# EasyEDA schematic Stepper Hat Trio V3.9.json
TITLE: Pi ESP Stepper HAT; REV: 3.9; Date: 2019-09-20; Sheet: 1/1; Drawn By: robdobsn
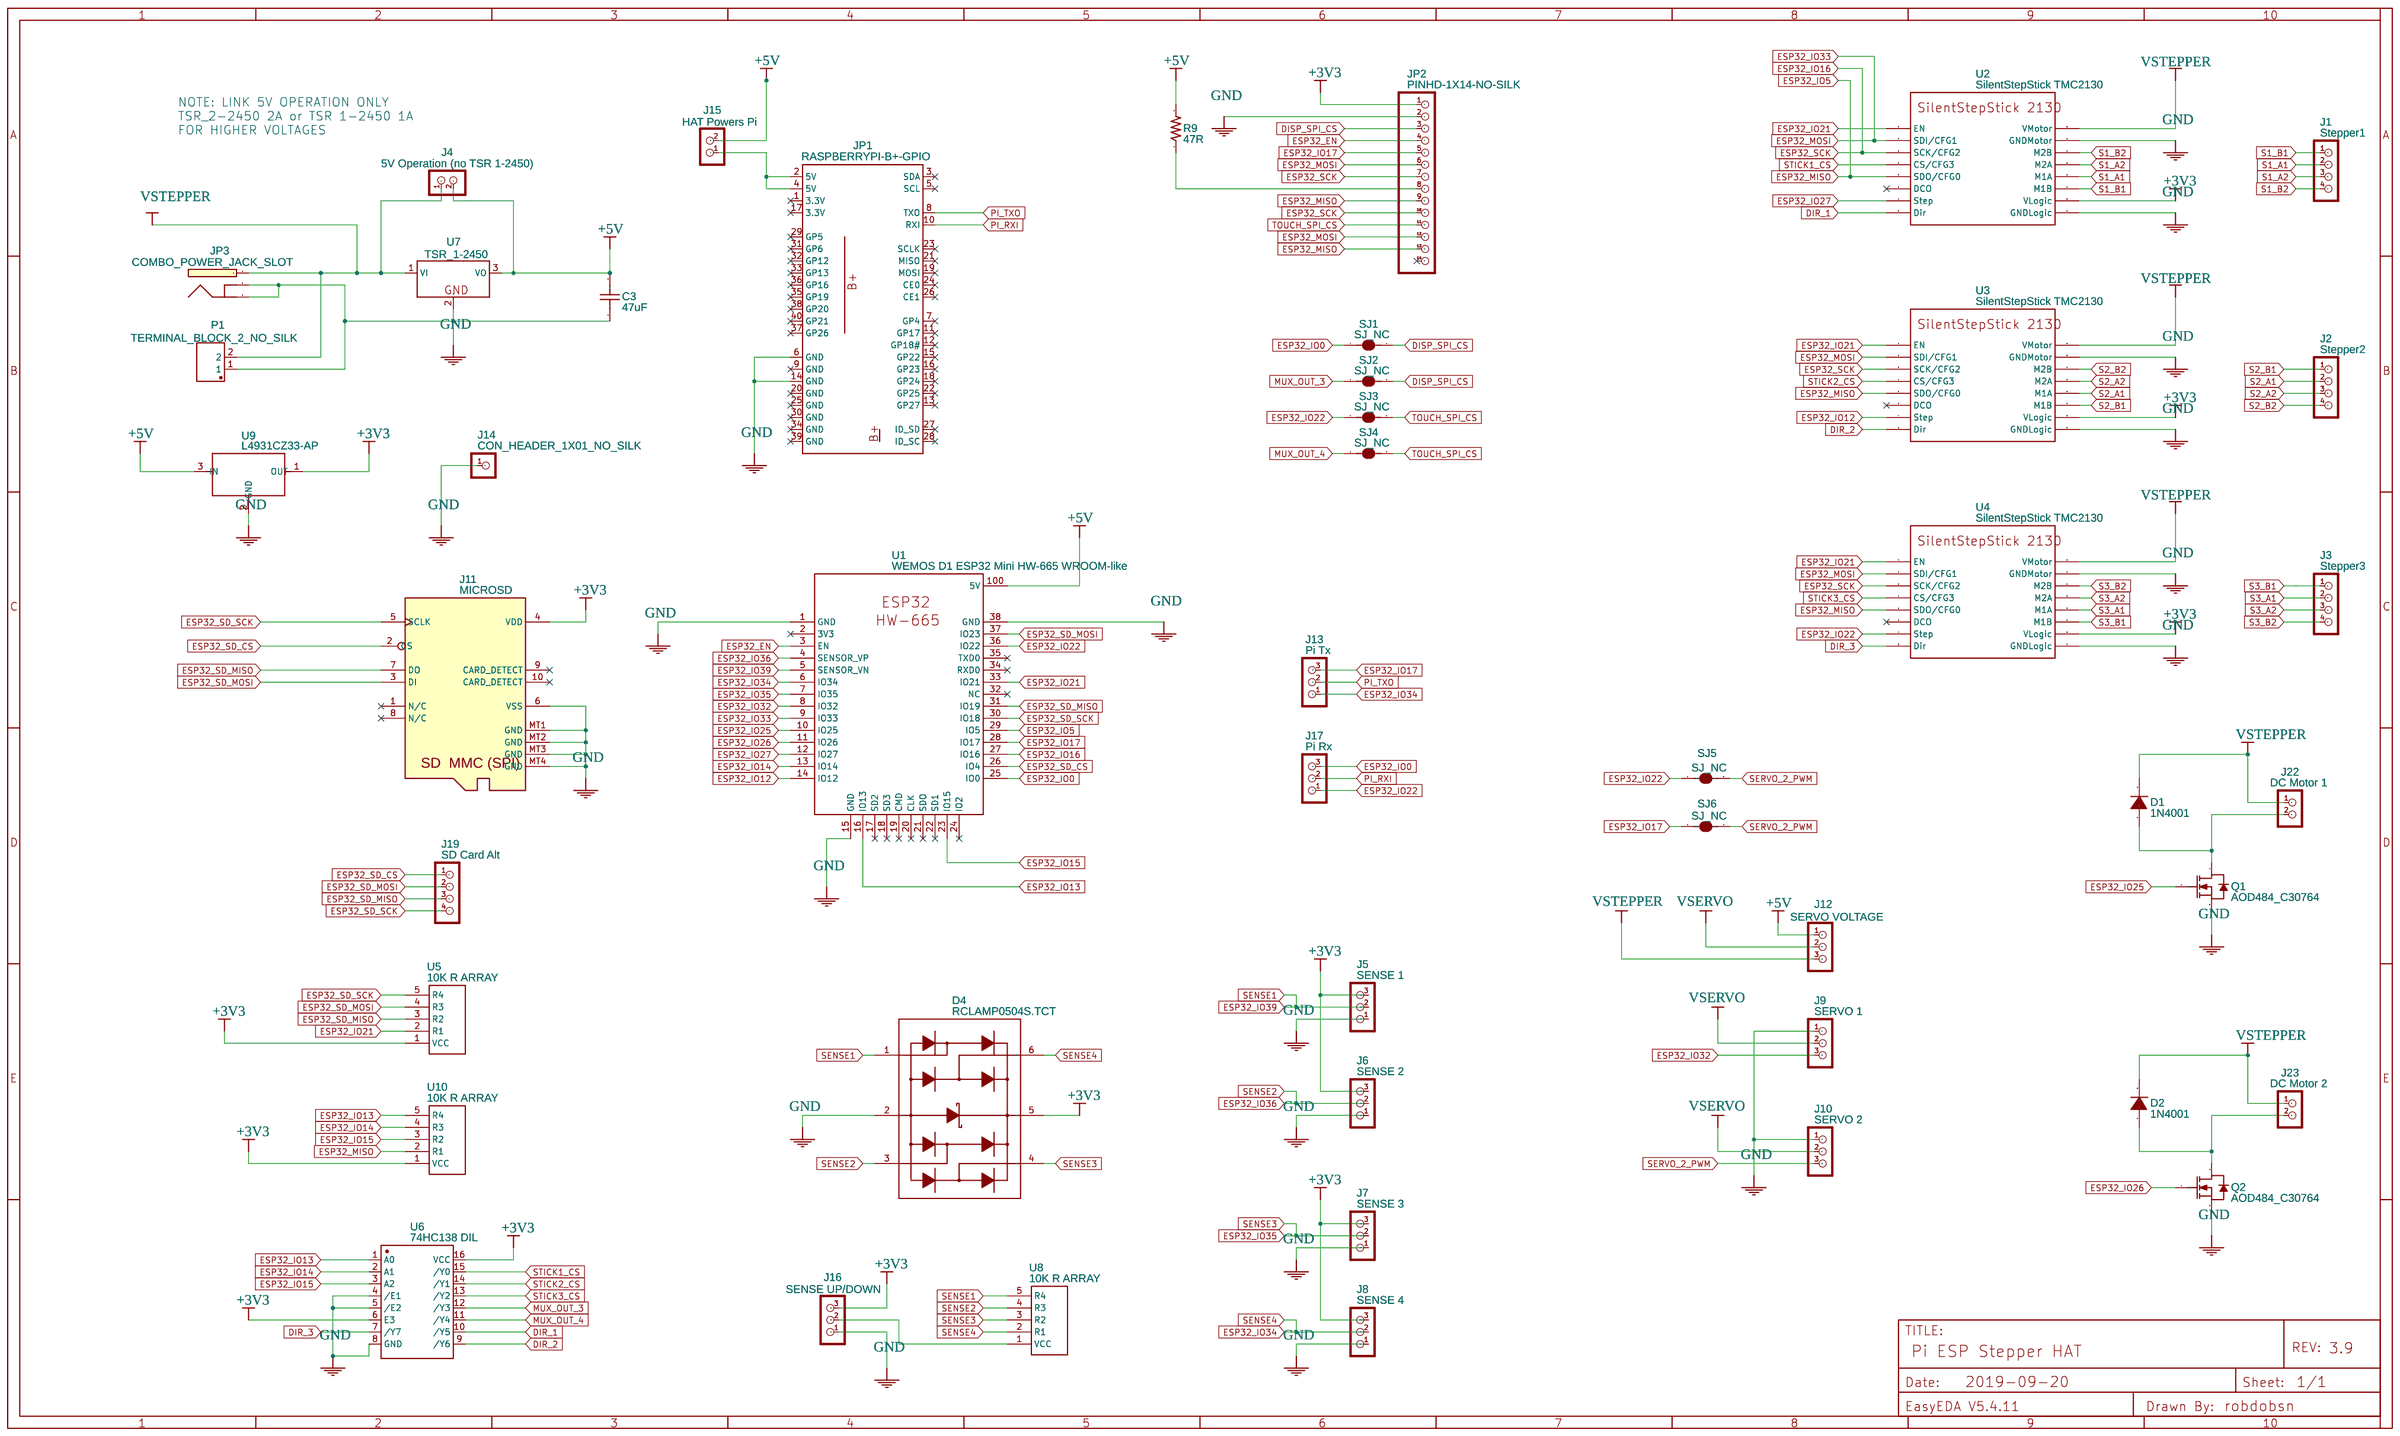
[diagram p0: schematic sheet]

## Parts
C3  47uF  [1206]
D1  1N4001  [DO-41]
D2  1N4001  [DO-41]
D4  RCLAMP0504S.TCT  [SOT-23-6]
J1  Stepper1  [1X04_NO_SILK]
J2  Stepper2  [1X04_NO_SILK]
J3  Stepper3  [1X04_NO_SILK]
J4  5V Operation (no TSR 1-2450)  [1X02_NO_SILK]
J5  SENSE 1  [1X03_NO_SILK]
J6  SENSE 2  [1X03_NO_SILK]
J7  SENSE 3  [1X03_NO_SILK]
J8  SENSE 4  [1X03_NO_SILK]
J9  SERVO 1  [1X03_NO_SILK]
J10  SERVO 2  [1X03_NO_SILK]
J11  MICROSD  [MOLEX SD-503398-003-2]
J12  SERVO VOLTAGE  [1X03_NO_SILK]
J13  Pi Tx  [1X03_NO_SILK]
J14  CON_HEADER_1X01_NO_SILK  [M1X2_10_17_NO_SILK]
J15  HAT Powers Pi  [1X02_NO_SILK]
J16  SENSE UP/DOWN  [1X03_NO_SILK]
J17  Pi Rx  [1X03_NO_SILK]
J19  SD Card Alt  [1X04_NO_SILK]
J22  DC Motor 1  [1X02_NO_SILK]
J23  DC Motor 2  [1X02_NO_SILK]
JP1  RASPBERRYPI-B+-GPIO  [2X20_NOSILK]
JP2  PINHD-1X14-NO-SILK  [1X14_NO_SILK]
JP3  COMBO_POWER_JACK_SLOT  [COMBO POWER JACK SLOT]
P1  TERMINAL_BLOCK_2_NO_SILK  [PCB TERMINAL BLOCK NO SILK 5 MM]
Q1  AOD484_C30764  [TO-252-2]
Q2  AOD484_C30764  [TO-252-2]
R9  47R  [AXIAL-5.0X2.5(1/4W)]
SJ1  SJ_NC  [SJ_NC]
SJ2  SJ_NC  [SJ_NC]
SJ3  SJ_NC  [SJ_NC]
SJ4  SJ_NC  [SJ_NC]
SJ5  SJ_NC  [SJ_NC]
SJ6  SJ_NC  [SJ_NC]
U1  WEMOS D1 ESP32 Mini HW-665 WROOM-like  [WEMOS D1 ESP32]
U2  SilentStepStick TMC2130  [SILENTSTEPSTICK]
U3  SilentStepStick TMC2130  [SILENTSTEPSTICK]
U4  SilentStepStick TMC2130  [SILENTSTEPSTICK]
U5  10K R ARRAY  [RARRAY_4_COMMON]
U6  74HC138 DIL  [DIP254P762X508-16]
U7  TSR_1-2450  [TSR-1]
U8  10K R ARRAY  [RARRAY_4_COMMON]
U9  L4931CZ33-AP  [TO-92]
U10  10K R ARRAY  [RARRAY_4_COMMON]

## Library data of the parts
C3 = GRM31CR60J107ME39L: Supplier: LCSC; Manufacturer: MuRata; Tolerance: ±20%; Rated Voltage: 6.3V; Supplier Part: C77085
D1 D2 = -: Supplier: LCSC; Manufacturer: LRC; Supplier Part: C82804
D4 = -: Supplier: LCSC; Manufacturer: SEMTECH; Contributor: LCSC; Supplier Part: C132260; LCSC Assembly: Yes; SMT Type: Extend
J1-J3 = -: catid: 20; Contributor: DangerousPrototype; sourceId: QkQ82kCwO; Manufacturer Part: ?
J4 J15 J22 J23 = -: catid: 20; Contributor: DangerousPrototype; sourceId: t7e82kCUO; Manufacturer Part: ?
J5-J10 J12 J13 J16 J17 = -: catid: 20; Contributor: DangerousPrototype; sourceId: DBvMGYgys; Manufacturer Part: ?
J11 = -: Supplier: Digi-Key; Manufacturer: Molex; Manufacturer part: 5033981892; Manufacturer Part: ?; Supplier Part: WM11190CT-ND
J14 JP2 = -: Contributor: robdobsn
J19 = -: Contributor: DangerousPrototype
JP1 = -: Raspberry Pi B+ GPIO Header; catid: 20; Contributor: SparkFun; sourceId: 7PlfxP71G; Manufacturer Part: ?
JP3 = -: Power Jack; Contributor: robdobsn
P1 = -: Supplier: LCSC; Manufacturer: ReliaPro; Manufacturer Part: WJ2EDGV-5.08-2P; image: //image.lceda.cn/szlcsc/C8461.jpg; Contributor: robdobsn; Supplier Part: C8461
Q1 Q2 = -: Supplier Part: C30764; Supplier: LCSC; Manufacturer: AOS; Manufacturer Part: AOD484
R9 = -: Contributor: SparkFun; Manufacturer Part: ?
SJ1-SJ6 = -: Solder Jumper; Contributor: robdobsn
U1 = -: Manufacturer: WEMOS; Supplier: WEMOS; Supplier Part: WEMOS_D1_ESP32; Contributor: robdobsn
U2-U4 = -: Supplier Part: 20160027; Supplier: Watterott; link: https://www.watterott.com/en/SilentStepStick; Contributor: robdobsn
U5 U8 U10 = -: Manufacturer Part: 4605X-AP1-103LF; Contributor: robdobsn; link: none; Supplier Part: 652-4605X-AP1-103LF; Manufacturer: Bourns
U6 = -: Supplier Part: C2913; Supplier: LCSC; Manufacturer: FM; Manufacturer Part: 74HC138
U7 = -: catid: 20; sourceId: xCcoYy8Hh; Manufacturer Part: TSR 1-2433; Supplier: Element14; Supplier Part: 1696319
U9 = -: DIP PMIC Voltage Regulators LDO 3.3V 250mA;; sourceId: MAoK6rNxT

## Nets
+3V3: D4.5 J5.3 J6.3 J7.3 J8.3 J11.4(VDD) J16.3 JP2.1 U2.10(VLogic) U3.10(VLogic) U4.10(VLogic) U5.1(VCC) U6.6(E3) U6.16(VCC) U9.1(OUT) U10.1(VCC)
+5V: C3.2 J4.2 J12.1 J15.2 R9.2 U1.100(5V) U7.3(VO) U9.3(IN)
GND: C3.1 D4.2 J5.1 J6.1 J7.1 J8.1 J9.1 J10.1 J11.6(VSS) J11.MT1(GND) J11.MT2(GND) J11.MT3(GND) J11.MT4(GND) J14.1 J16.1 JP1.6(GND) JP1.14(GND) JP2.2 JP3.2(GNDBREAK) JP3.3(GND) P1.1 Q1.3(S) Q2.3(S) U1.1(GND) U1.15(GND) U1.38(GND) U2.9(GNDLogic) U2.15(GNDMotor) U3.9(GNDLogic) U3.15(GNDMotor) U4.9(GNDLogic) U4.15(GNDMotor) U6.4(/E1) U6.5(/E2) U6.8(GND) U7.2(GND) U9.2(GND)
DIR_1: U2.8(Dir) U6.10(/Y5)
DIR_2: U3.8(Dir) U6.9(/Y6)
DIR_3: U4.8(Dir) U6.7(/Y7)
DISP_SPI_CS: JP2.3 SJ1.2 SJ2.2
ESP32_EN: JP2.4 U1.3(EN)
ESP32_IO0: J17.3 SJ1.1 U1.25(IO0)
ESP32_IO5: JP2.9 JP2.13 U1.29(IO5) U2.5(SDO/CFG0) U3.5(SDO/CFG0) U4.5(SDO/CFG0) U10.2(R1)
ESP32_IO12: U1.14(IO12) U3.7(Step)
ESP32_IO13: U1.16(IO13) U6.1(A0) U10.5(R4)
ESP32_IO14: U1.13(IO14) U6.2(A1) U10.4(R3)
ESP32_IO15: U1.23(IO15) U6.3(A2) U10.3(R2)
ESP32_IO16: JP2.7 JP2.10 U1.27(IO16) U2.3(SCK/CFG2) U3.3(SCK/CFG2) U4.3(SCK/CFG2)
ESP32_IO17: J13.3 JP2.5 SJ6.1 U1.28(IO17)
ESP32_IO21: U1.33(IO21) U2.1(EN) U3.1(EN) U4.1(EN) U5.2(R1)
ESP32_IO22: J17.1 SJ3.1 SJ5.1 U1.36(IO22) U4.7(Step)
ESP32_IO25: Q1.1(G) U1.10(IO25)
ESP32_IO26: Q2.1(G) U1.11(IO26)
ESP32_IO27: U1.12(IO27) U2.7(Step)
ESP32_IO32: J9.3 U1.8(IO32)
ESP32_IO33: JP2.6 JP2.12 U1.9(IO33) U2.2(SDI/CFG1) U3.2(SDI/CFG1) U4.2(SDI/CFG1)
ESP32_IO34: D4.6 J8.2 J13.1 U1.6(IO34) U8.2(R1)
ESP32_IO35: D4.4 J7.2 U1.7(IO35) U8.3(R2)
ESP32_IO36: D4.3 J6.2 U1.4(SENSOR_VP) U8.4(R3)
ESP32_IO39: D4.1 J5.2 U1.5(SENSOR_VN) U8.5(R4)
ESP32_SD_CS: J11.2(CS) J19.1 U1.26(IO4)
ESP32_SD_MISO: J11.7(DO) J19.3 U1.31(IO19) U5.3(R2)
ESP32_SD_MOSI: J11.3(DI) J19.2 U1.37(IO23) U5.4(R3)
ESP32_SD_SCK: J11.5(SCLK) J19.4 U1.30(IO18) U5.5(R4)
MUX_OUT_3: SJ2.1 U6.12(/Y3)
MUX_OUT_4: SJ4.1 U6.11(/Y4)
PI_RXI: J17.2 JP1.10(RXI)
PI_TXO: J13.2 JP1.8(TXO)
S1_A1: J1.2 U2.12(M1A)
S1_A2: J1.3 U2.13(M2A)
S1_B1: J1.1 U2.11(M1B)
S1_B2: J1.4 U2.14(M2B)
S2_A1: J2.2 U3.12(M1A)
S2_A2: J2.3 U3.13(M2A)
S2_B1: J2.1 U3.11(M1B)
S2_B2: J2.4 U3.14(M2B)
S3_A1: J3.2 U4.12(M1A)
S3_A2: J3.3 U4.13(M2A)
S3_B1: J3.1 U4.11(M1B)
S3_B2: J3.4 U4.14(M2B)
SERVO_2_PWM: J10.3 SJ5.2 SJ6.2
STICK1_CS: U2.4(CS/CFG3) U6.15(/Y0)
STICK2_CS: U3.4(CS/CFG3) U6.14(/Y1)
STICK3_CS: U4.4(CS/CFG3) U6.13(/Y2)
TOUCH_SPI_CS: JP2.11 SJ3.2 SJ4.2
VSERVO: J9.2 J10.2 J12.2
VSTEPPER: D1.2(K) D2.2(K) J4.1 J12.3 J22.1 J23.1 JP3.1(PWR) P1.2 U2.16(VMotor) U3.16(VMotor) U4.16(VMotor) U7.1(VI)
Net-(D1-1): D1.1(A) J22.2 Q1.4(D)
Net-(D2-1): D2.1(A) J23.2 Q2.4(D)
Net-(J15-1): J15.1 JP1.2(5V) JP1.4(5V)
Net-(J16-2): J16.2 U8.1(VCC)
Net-(JP2-8): JP2.8 R9.1

Not connected (* = marked no-connect by the designer): J11 1(N/C)* 8(N/C)* 9(CARD_DETECT)* 10(CARD_DETECT)*; JP1 1(3.3V)* 3(SDA)* 5(SCL)* 7(GP4)* 9(GND)* 11(GP17)* 12(GP18#)* 13(GP27)* 15(GP22)* 16(GP23)* 17(3.3V)* 18(GP24)* 19(MOSI)* 20(GND)* 21(MISO)* 22(GP25)* 23(SCLK)* 24(CE0)* 25(GND)* 26(CE1)* 27(ID_SD)* 28(ID_SC)* 29(GP5)* 30(GND)* 31(GP6)* 32(GP12)* 33(GP13)* 34(GND)* 35(GP19)* 36(GP16)* 37(GP26)* 38(GP20)* 39(GND)* 40(GP21)*; JP2 14*; U1 2(3V3)* 17(SD2)* 18(SD3)* 19(CMD)* 20(CLK)* 21(SDO)* 22(SD1)* 24(IO2)* 32(NC)* 34(RXD0)* 35(TXD0)*; U2 6(DCO)*; U3 6(DCO)*; U4 6(DCO)*

## Notes on the sheet
- NOTE: LINK 5V OPERATION ONLY
  TSR_2-2450 2A or TSR 1-2450 1A
  FOR HIGHER VOLTAGES
